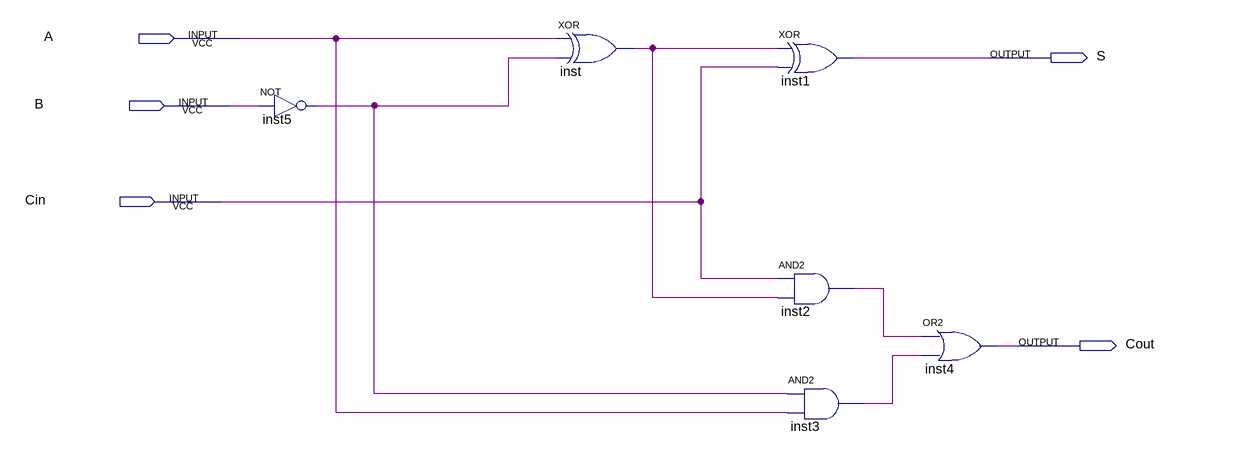
[diagram p0: schematic sheet]
// Quartus schematic Full_Suber.bdf as structural Verilog: 6 symbols, 5 pins
module Full_Suber (
  input  A,
  input  B,
  input  Cin,
  output S,
  output Cout
);

  wire inst2_out, inst3_out, inst5_out, inst_out;

  not inst5 (inst5_out, B);
  xor inst (inst_out, A, inst5_out);
  xor inst1 (S, inst_out, Cin);
  and inst2 (inst2_out, Cin, inst_out);
  and inst3 (inst3_out, inst5_out, A);
  or inst4 (Cout, inst2_out, inst3_out);
endmodule
